# EAGLE design IMU_v2 (EAGLE 6.6.0)
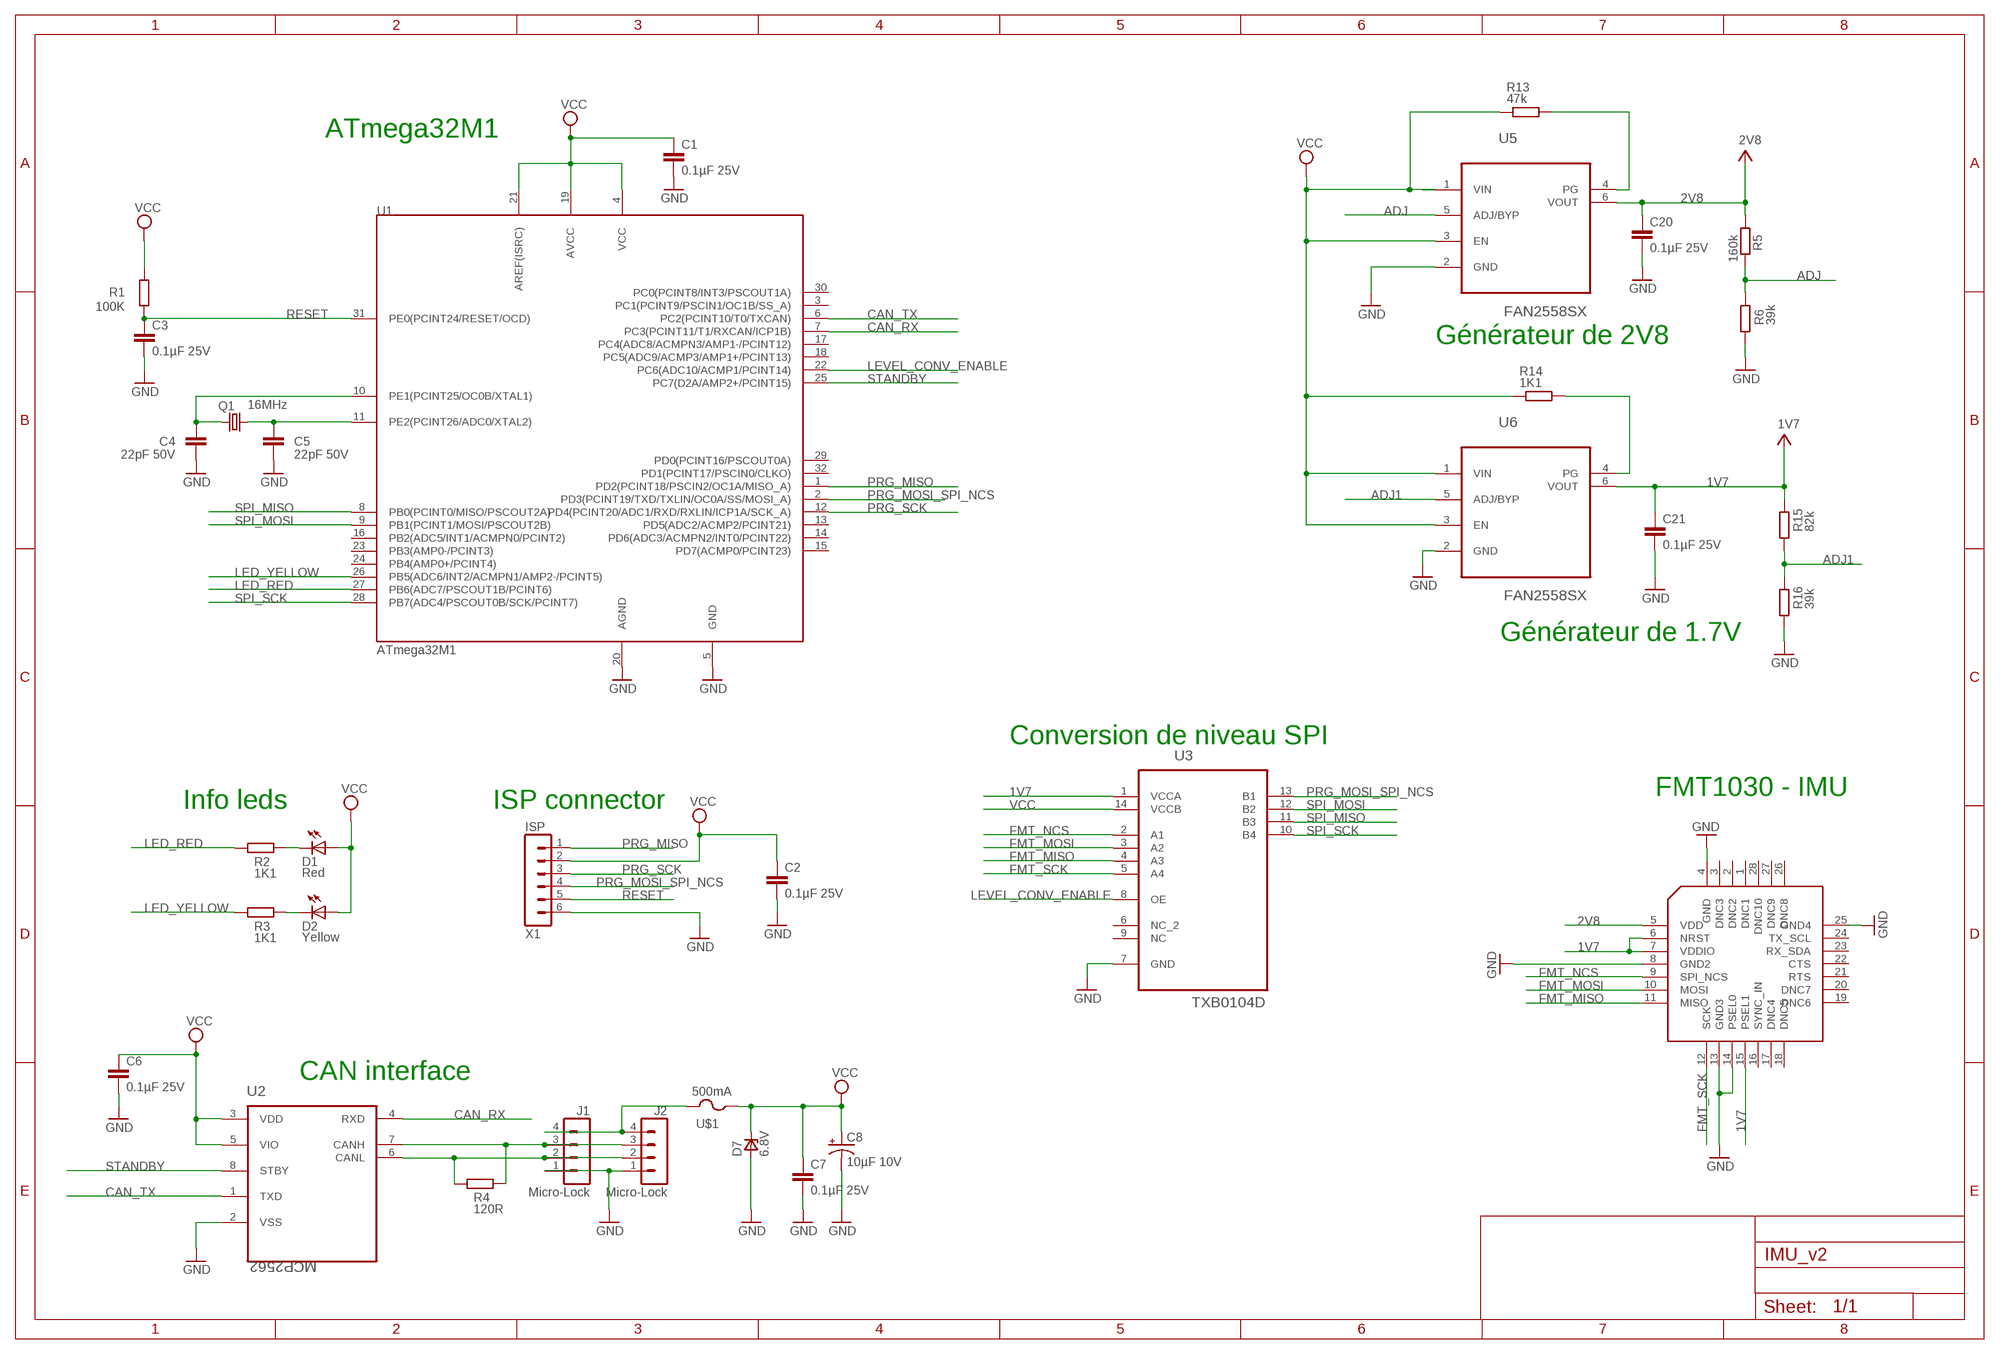
[diagram p0: schematic, sheet 1]

## Parts
C1  0.1µF 25V  CAPACITOR_NON_POL-0.1µF-25V(+-10%)(2012)  [C2012]
C2  0.1µF 25V  CAPACITOR_NON_POL-0.1µF-25V(+-10%)(2012)  [C2012]
C3  0.1µF 25V  CAPACITOR_NON_POL-0.1µF-25V(+-10%)(2012)  [C2012]
C4  22pF 50V  CAPACITOR_NON_POL-22PF-50V(+-5%)(2012)  [C2012]
C5  22pF 50V  CAPACITOR_NON_POL-22PF-50V(+-5%)(2012)  [C2012]
C6  0.1µF 25V  CAPACITOR_NON_POL-0.1µF-25V(+-10%)(2012)  [C2012]
C7  0.1µF 25V  CAPACITOR_NON_POL-0.1µF-25V(+-10%)(2012)  [C2012]
C8  10µF 10V  CAPACITOR_POL-10µF-10V(+-10%)(3216)  [EIA3216]
C20  0.1µF 25V  CAPACITOR_NON_POL-0.1µF-25V(+-10%)(2012)  [C2012]
C21  0.1µF 25V  CAPACITOR_NON_POL-0.1µF-25V(+-10%)(2012)  [C2012]
D1  Red  LEDVLDS1235G  [VLD]
D2  Yellow  LED-VLDY1235G  [VLD]
D7  6.8V  ZENER_UNIDIR6.8  [DO-214AA]
J1  Micro-Lock  MICROLOCK-4CMS  [504195-0470]
J2  Micro-Lock  MICROLOCK-4CMS  [504195-0470]
Q1  16MHz  CRYSTAL-16MHZ_SMD(3225)  [SMD_KX7]
R1  100K  RESISTOR-100K(+-1%)(2012)  [R2012]
R2  1K1  RESISTOR-1K1(+-1%)(2012)  [R2012]
R3  1K1  RESISTOR-1K1(+-1%)(2012)  [R2012]
R4  120R  RESISTOR-120R(+-1%)(2012)  [R2012]
R5  160k  RESISTOR-1K1(+-1%)(2012)  [R2012]
R6  39k  RESISTOR-1K1(+-1%)(2012)  [R2012]
R13  47k  RESISTOR-1K1(+-1%)(2012)  [R2012]
R14  1K1  RESISTOR-1K1(+-1%)(2012)  [R2012]
R15  82k  RESISTOR-1K1(+-1%)(2012)  [R2012]
R16  39k  RESISTOR-1K1(+-1%)(2012)  [R2012]
U1  ATmega32M1  ATMEGA32M1-TQFP32  [TQFP32]
U2  MCP2562  MCP2562-E/SN-SOIC8  [SOIC8]
U3  TXB0104D  [SOIC127P600X175-14N]
U5  FAN2558SX  [SOT95P270X145-6N]
U6  FAN2558SX  [SOT95P270X145-6N]
U$1  500mA  FUSE  [EIARS-481-2]
U$2  FMT1030  [S28]
X1  ISP  MINITEK_127_6WAYS-SMD  [MINITEK_127_6WAY_SMD]

## Nets
1V7: C21.1 R15.1 U3.1(VCCA) U6.6(VOUT) U$2.6(NRST) U$2.7(VDDIO) U$2.15(PSEL1)
2V8: C20.1 R5.1 U5.6(VOUT) U$2.5(VDD)
ADJ: R5.2 R6.1 U5.5(ADJ/BYP)
ADJ1: R15.2 R16.1 U6.5(ADJ/BYP)
CAN_RX: U1.7(PC3(PCINT11/T1/RXCAN/ICP1B)) U2.4(RXD)
CAN_TX: U1.6(PC2(PCINT10/T0/TXCAN)) U2.1(TXD)
FMT_MISO: U3.4(A3) U$2.11(MISO)
FMT_MOSI: U3.3(A2) U$2.10(MOSI)
FMT_NCS: U3.2(A1) U$2.9(SPI_NCS)
FMT_SCK: U3.5(A4) U$2.12(SCK)
GND: C1.2 C2.2 C3.2 C4.2 C5.2 C6.2 C7.2 C8.C(-) C20.2 C21.2 D7.A J1.1 J2.1 R6.2 R16.2 U1.5(GND) U1.20(AGND) U2.2(VSS) U3.7(GND) U5.2(GND) U6.2(GND) U$2.4(GND) U$2.8(GND2) U$2.13(GND3) U$2.14(PSEL0) U$2.25(GND4) X1.6
LED_RED: R2.2 U1.27(PB6(ADC7/PSCOUT1B/PCINT6))
LED_YELLOW: R3.2 U1.26(PB5(ADC6/INT2/ACMPN1/AMP2-/PCINT5))
LEVEL_CONV_ENABLE: U1.22(PC6(ADC10/ACMP1/PCINT14)) U3.8(OE)
N$2: D1.C R2.1
N$3: D2.C R3.1
N$4: J1.4 J2.4 U$1.2
N$5: J1.2 J2.2 R4.2 U2.6(CANL)
N$6: J1.3 J2.3 R4.1 U2.7(CANH)
N$7: C5.1 Q1.3 U1.11(PE2(PCINT26/ADC0/XTAL2))
N$9: C4.1 Q1.1 U1.10(PE1(PCINT25/OC0B/XTAL1))
N$12: R13.1 U5.4(PG)
N$14: R14.2 U6.4(PG)
PRG_MISO: U1.1(PD2(PCINT18/PSCIN2/OC1A/MISO_A)) X1.1
PRG_MOSI_SPI_NCS: U1.2(PD3(PCINT19/TXD/TXLIN/OC0A/SS/MOSI_A)) U3.13(B1) X1.4
PRG_SCK: U1.12(PD4(PCINT20/ADC1/RXD/RXLIN/ICP1A/SCK_A)) X1.3
RESET: C3.1 R1.1 U1.31(PE0(PCINT24/RESET/OCD)) X1.5
SPI_MISO: U1.8(PB0(PCINT0/MISO/PSCOUT2A)) U3.11(B3)
SPI_MOSI: U1.9(PB1(PCINT1/MOSI/PSCOUT2B)) U3.12(B2)
SPI_SCK: U1.28(PB7(ADC4/PSCOUT0B/SCK/PCINT7)) U3.10(B4)
STANDBY: U1.25(PC7(D2A/AMP2+/PCINT15)) U2.8(STBY)
VCC: C1.1 C2.1 C6.1 C7.1 C8.A(+) D1.A D2.A D7.C R1.2 R13.2 R14.1 U1.4(VCC) U1.19(AVCC) U1.21(AREF(ISRC)) U2.3(VDD) U2.5(VIO) U3.14(VCCB) U5.1(VIN) U5.3(EN) U6.1(VIN) U6.3(EN) U$1.1 X1.2
Unconnected: U1.3(PC1(PCINT9/PSCIN1/OC1B/SS_A)) U1.13(PD5(ADC2/ACMP2/PCINT21)) U1.14(PD6(ADC3/ACMPN2/INT0/PCINT22)) U1.15(PD7(ACMP0/PCINT23)) U1.16(PB2(ADC5/INT1/ACMPN0/PCINT2)) U1.17(PC4(ADC8/ACMPN3/AMP1-/PCINT12)) U1.18(PC5(ADC9/ACMP3/AMP1+/PCINT13)) U1.23(PB3(AMP0-/PCINT3)) U1.24(PB4(AMP0+/PCINT4)) U1.29(PD0(PCINT16/PSCOUT0A)) U1.30(PC0(PCINT8/INT3/PSCOUT1A)) U1.32(PD1(PCINT17/PSCIN0/CLKO)) U3.6(NC_2) U3.9(NC) U$2.1(DNC1) U$2.2(DNC2) U$2.3(DNC3) U$2.16(SYNC_IN) U$2.17(DNC4) U$2.18(DNC5) U$2.19(DNC6) U$2.20(DNC7) U$2.21(RTS) U$2.22(CTS) U$2.23(RX_SDA) U$2.24(TX_SCL) U$2.26(DNC8) U$2.27(DNC9) U$2.28(DNC10)

## Notes on the sheet
- ATmega32M1
- Générateur de 2V8
- Générateur de 1.7V
- Conversion de niveau SPI
- FMT1030 - IMU
- Info leds | ISP connector
- CAN interface

## Library data of the parts
C1-C3 C6 C7 C20 C21 = weklin_capacitor:CAPACITOR_NON_POL: Condensateur céramique multicouche; LIB: weklin_capacitor; MANUFACTURER: AVX; MPN: 08053C104KAT2A; OC_FARNELL: 2280951; PRICE: 0,0036
C4 C5 = weklin_capacitor:CAPACITOR_NON_POL: Condensateur céramique multicouche; LIB: weklin_capacitor; MANUFACTURER: Multicomp; MPN: MC0805N220J500CT; OC_FARNELL: 2310684; PRICE: 0,0078
C8 = weklin_capacitor:CAPACITOR_POL: Capacitor; LIB: weklin_capacitor; MANUFACTURER: Kemet; MPN: T491A106K010AT; OC_FARNELL: 2250086; PRICE: 0,0578
D1 = weklin_led:LED: Led; LIB: weklin_led; MANUFACTURER: Vishay; MPN: VLDS1235G; OC_FARNELL: 2494682; PRICE: 0,003
D2 = weklin_led:LED: Led; LIB: weklin_led; MANUFACTURER: Vishay; MPN: VLDY1235G; OC_FARNELL: 2494684; PRICE: 0,003
D7 = weklin_diode:ZENER_UNIDIR: P6SMBxxA Series of unidirectional Transient Voltage Suppressor Diodes xx = Stand-off Voltage VR in Volts; PPmax = 600 W Case: SMB = DO 214 AA Note: Footprint acc. to ST specs; source: www.st.com Author: Dipl.-Ing. FH Rainer Bayer, www.ing-rb.de/hhn Feedback: rainer.bayer@hs-heilbronn.de; LIB: weklin_diode; MANUFACTURER: ON Semiconductor; MPN: P6SMB6.8AT3G; OC_FARNELL: 1459166RL; PRICE: 0,178
J1 J2 = weklin_micro-lock:MICROLOCK-4: Connecteur MOLEX de 4 Contacts Série Mini50 GEII/IUT ANGERS; LIB: weklin_micro-lock; MANUFACTURER: Molex; MPN: 504195-0470; OC_FARNELL: 2445490; PRICE: 0,713
Q1 = weklin_crystal:CRYSTAL: Crystal resonator; LIB: weklin_crystal; MANUFACTURER: AEL CRYSTALS; MPN: E3SB16.0000F09G11AE; OC_FARNELL: 2467444RL; PRICE: 0,315
R1 = weklin_resistor:RESISTOR: Resistor; LIB: weklin_resistor; MANUFACTURER: Multicomp; MPN: MCWR08X1003FTL; OC_FARNELL: 2446868; PRICE: 0,0014
R2 R3 R14 = weklin_resistor:RESISTOR: Resistor; LIB: weklin_resistor; MANUFACTURER: Multicomp; MPN: MC0805S8F1101T5E; OC_FARNELL: 1635316; PRICE: 0,003
R4 = weklin_resistor:RESISTOR: Resistor; LIB: weklin_resistor; MANUFACTURER: Multicomp; MPN: MCWR08X1200FTL; OC_FARNELL: 2446878; PRICE: 0,0014
R5 R6 R13 R15 R16 = weklin_resistor:RESISTOR: Resistor; LIB: weklin_resistor; MANUFACTURER: Multicomp; MPN: MC0805S8F1101T5E; OC_FARNELL: 1635316; PRICE: 0,003; VALUE: 1K1
U1 = weklin_micro-atmell:ATMEGA32M1: ATMEL ATMEGA32M1-AU MCU 8 BITS ATMEGA 16MHZ; LIB: weklin_micro_atmell; MANUFACTURER: Atmel; MPN: ATmega32M1-AU; OC_FARNELL: 2443180; PRICE: 6,18
U2 = weklin_ic_can:MCP2562-E/SN: High-Speed CAN Transceiver; LIB: weklin_ic_can; MANUFACTURER: Microchip; MPN: MCP2562-E/SN; OC_FARNELL: 2362839; PRICE: 1,12
U3 = TXB0104D:TXB0104D: 4-BIT BIDIRECTIONAL VOLTAGE-LEVEL TRANSLATOR WITH AUTOMATIC DIRECTION SENSING AND ±15-kV ESD PROTECTION; MPN: TXB0104D; OC_FARNELL: 1607890; OC_NEWARK: 99K4464; PACKAGE: SOIC-14; SUPPLIER: TEXAS INSTRUMENTS
U5 U6 = FAN2558:FAN2558SX: 180mA Low Voltage CMOS LDO; MANUFACTURER: FAN2558SX; OC_FARNELL: 1564482; OC_NEWARK: 82H9202; PACKAGE: SOT-23-6; SUPPLIER: Fairchild
U$1 = weklin_fuse:FUSE: Fuse 500mA 125V ultra fast; LIB: weklin_fuse; MANUFACTURER: Littlefuse; MPN: 0451.500MRL; OC_FARNELL: 2383271; PRICE: 0,527
U$2 = Mercier:FMT1030
X1 = weklin_connector:MINITEK_127_6WAYS: Board-To-Board Connector, Micro-MaTch Series, Embase, 6voies.; LIB: weklin_connector; MANUFACTURER: Minitek; MPN: 20021121-00006C4LF; OC_FARNELL: 1865277; PRICE: 0,333

## Board
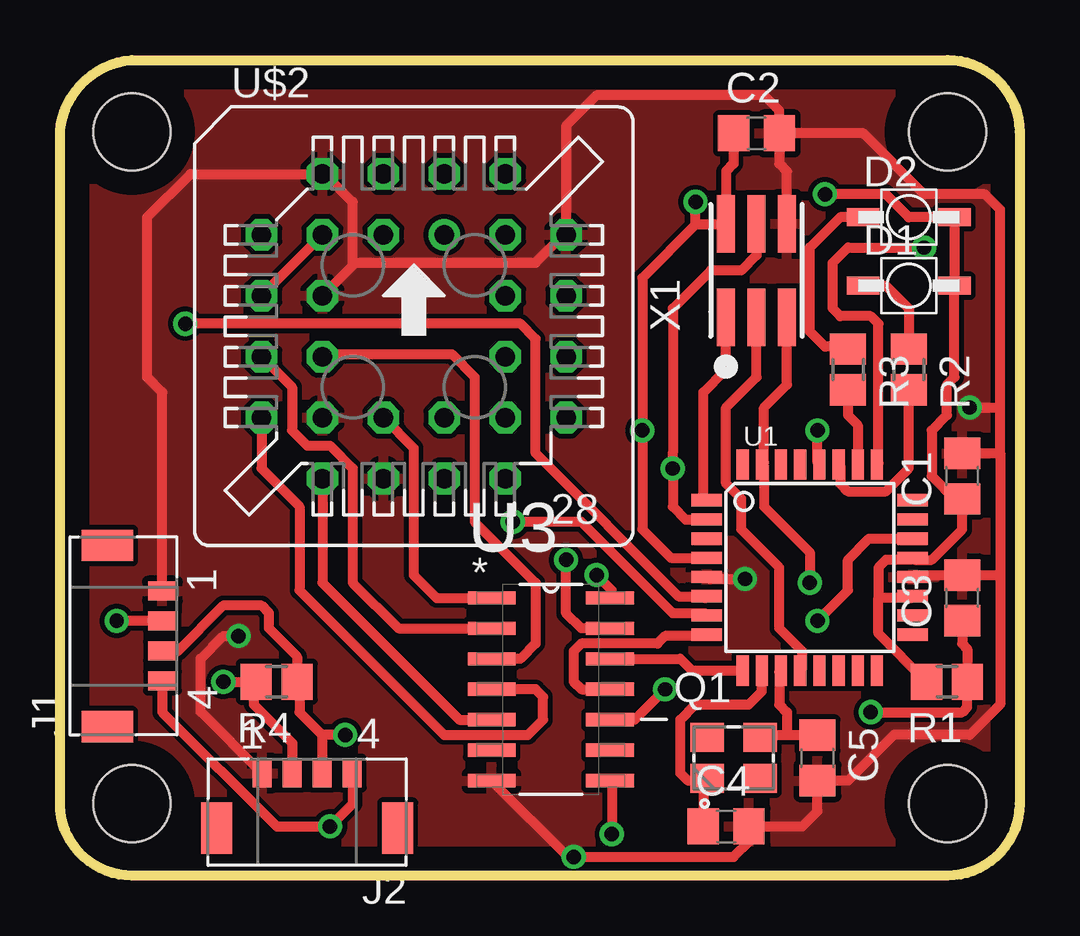
[diagram p1: board, top side]
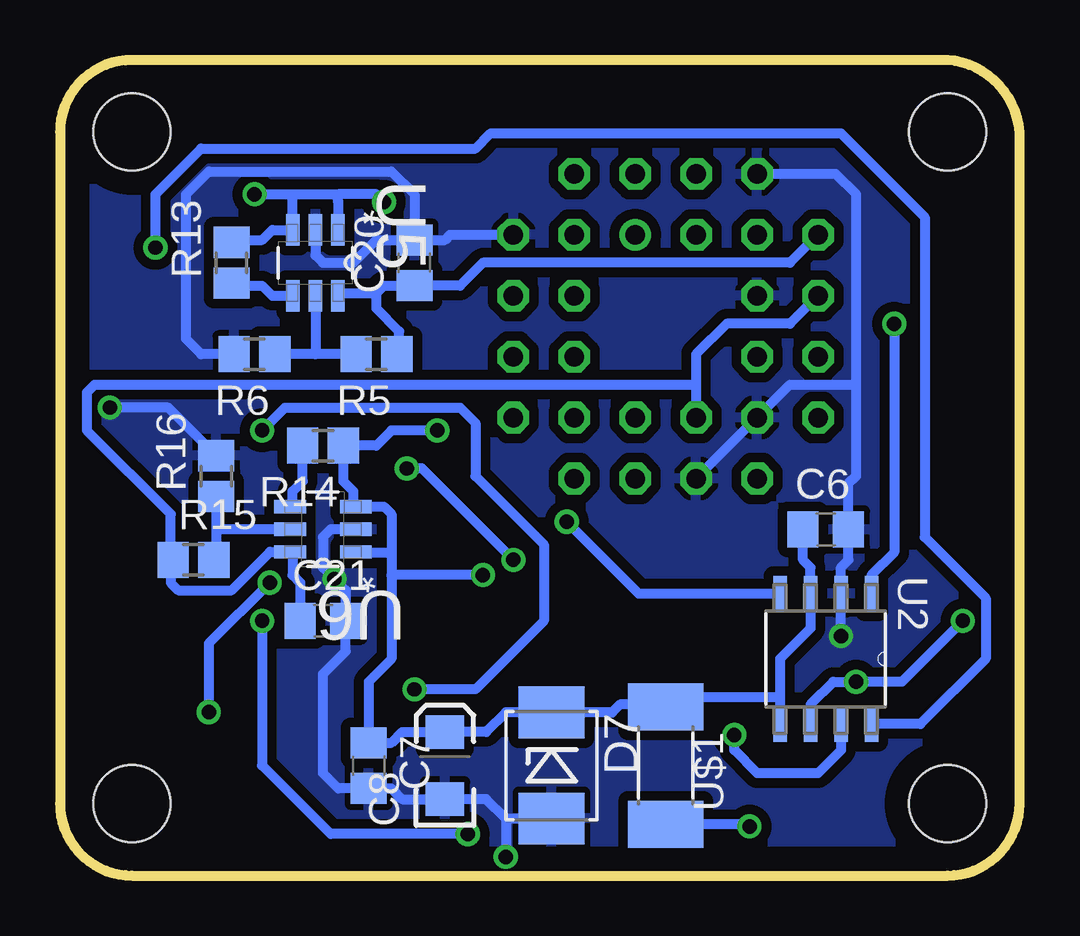
[diagram p2: board, bottom side, seen from below]

Size 40 x 34 mm. Coordinates in mm from the lower left corner, seen from the top.
Outline: 0,31 arc-81 3,34 37,34 arc-90 40,31 40,3 arc-90 37,0 3,0 arc-90 0,3 0,31
Copper layers (1*16): Top 0.035mm / dielectric 1.5mm / Bottom 0.035mm
Design rules "default": minimum track width 10mil, minimum drill 24mil, track to track 8mil, track to pad 8mil, pad to pad 8mil, via to via 8mil, smd to smd 8mil, copper to edge 40mil, drill to drill 8mil, minimum pad ring 10mil, minimum via ring 8mil, stop-mask expansion 4mil, vias tented up to drill 0mil, thermal gap 10mil
Holes 3.2 mm at 3,3 37,3 37,31 3,31

### Footprints (pad centres in the part's own frame; a part is rotated, then mirrored left to right if it is on the bottom)
C2012 = smd 1.3 x 1.5: 1 -0.95,0; 2 0.95,0
EIA3216 = smd 1.4 x 1.6: A 1.4,0; C -1.4,0
VLD = smd 0.75 x 1.35: A 0,1.9; C 0,-1.9
DO-214AA = smd 2.159 x 2.743: A 2.21,0; C -2.21,0
504195-0470 = smd 0.8 x 1.2: 1 1.875,0; 2 0.625,0; 3 -0.625,0; 4 -1.875,0 | smd 1.3 x 2.15: P$5 -3.775,2.295; P$6 3.775,2.295
SMD_KX7 = smd 1.4 x 1.2: 1 -1.1,-0.85; 2 1.1,-0.85; 3 1.1,0.85; 4 -1.1,0.85
R2012 = smd 1.3 x 1.5: 1 -0.85,0; 2 0.85,0
TQFP32 = smd 1.27 x 0.508: 1 -4.293,2.8; 2 -4.293,2; 3 -4.293,1.2; 4 -4.293,0.4; 5 -4.293,-0.4; 6 -4.293,-1.2; 7 -4.293,-2; 8 -4.293,-2.8; 17 4.293,-2.8; 18 4.293,-2; 19 4.293,-1.2; 20 4.293,-0.4; 21 4.293,0.4; 22 4.293,1.2; 23 4.293,2; 24 4.293,2.8 | smd 0.508 x 1.27: 9 -2.8,-4.293; 10 -2,-4.293; 11 -1.2,-4.293; 12 -0.4,-4.293; 13 0.4,-4.293; 14 1.2,-4.293; 15 2,-4.293; 16 2.8,-4.293; 25 2.8,4.293; 26 2,4.293; 27 1.2,4.293; 28 0.4,4.293; 29 -0.4,4.293; 30 -1.2,4.293; 31 -2,4.293; 32 -2.8,4.293
SOIC8 = smd 1.473 x 0.559: 1 -2.718,1.905; 2 -2.718,0.635; 3 -2.718,-0.635; 4 -2.718,-1.905; 5 2.718,-1.905; 6 2.718,-0.635; 7 2.718,0.635; 8 2.718,1.905
SOIC127P600X175-14N = smd 1.981 x 0.559: 1 -2.464,3.81; 2 -2.464,2.54; 3 -2.464,1.27; 4 -2.464,0; 5 -2.464,-1.27; 6 -2.464,-2.54; 7 -2.464,-3.81; 8 2.464,-3.81; 9 2.464,-2.54; 10 2.464,-1.27; 11 2.464,0; 12 2.464,1.27; 13 2.464,2.54; 14 2.464,3.81
SOT95P270X145-6N = smd 1.321 x 0.559: 1 -1.372,0.94; 2 -1.372,0; 3 -1.372,-0.94; 4 1.372,-0.94; 5 1.372,0; 6 1.372,0.94
EIARS-481-2 = smd 1.956 x 3.15: 1 -2.451,0; 2 2.451,0
S28 = drill 0.813: 1 1.27,3.81 | drill 0.813 octagon: 2 -1.27,6.35; 3 -1.27,3.81; 4 -3.81,6.35; 5 -6.35,3.81; 6 -3.81,3.81; 7 -6.35,1.27; 8 -3.81,1.27; 9 -6.35,-1.27; 10 -3.81,-1.27; 11 -6.35,-3.81; 12 -3.81,-6.35; 13 -3.81,-3.81; 14 -1.27,-6.35; 15 -1.27,-3.81; 16 1.27,-6.35; 17 1.27,-3.81; 18 3.81,-6.35; 19 6.35,-3.81; 20 3.81,-3.81; 21 6.35,-1.27; 22 3.81,-1.27; 23 6.35,1.27; 24 3.81,1.27; 25 6.35,3.81; 26 3.81,6.35; 27 3.81,3.81; 28 1.27,6.35
MINITEK_127_6WAY_SMD = smd 0.76 x 2.4: 1 -1.27,-1.95; 2 -1.27,1.95; 3 0,-1.95; 4 0,1.95; 5 1.27,-1.95; 6 1.27,1.95

### Placement (x,y rotation side)
C1  37.61,16.65 90 top
C2  29.04,30.94 0 top
C3  37.61,11.57 90 top
C4  27.77,2.05 0 top
C5  31.57,4.91 270 top
C6  8.08,14.43 0 bottom
C7  27.13,4.59 270 bottom
C8  23.95,4.59 90 bottom
C20  25.23,25.54 90 bottom
C21  29.04,10.62 0 bottom
D1  35.38,24.59 270 top
D2  35.38,27.45 270 top
D7  19.51,4.59 270 bottom
J1  4.27,9.98 90 top
J2  10.3,4.27 180 top
Q1  28.08,4.91 0 top
R1  36.97,8.08 180 top
R2  35.38,21.1 270 top
R3  32.84,21.1 270 top
R4  9.03,8.08 180 top
R5  26.81,21.73 180 bottom
R6  31.89,21.73 180 bottom
R13  32.84,25.54 90 bottom
R14  29.04,17.92 180 bottom
R15  34.43,13.16 0 bottom
R16  33.48,16.65 90 bottom
U1  31.26,12.84 0 top
U2  8.08,9.03 270 bottom
U3  20.46,7.76 0 top
U5  29.35,25.54 270 bottom
U6  29.04,14.43 180 bottom
U$1  14.75,4.59 270 bottom
U$2  14.75,22.9 0 top
X1  29.04,25.23 0 top

### Tracks (layer width: path | path; a pad name or v marks a point on that pad's centre or on a via)
1V7
  Top 0.406: U$2.15 14.75,17.82 14.75,12.53 15.7,11.57 U3.1 | U$2.7 U$2.6
  Bottom 0.406: C21.1 29.98,12.21 30.3,12.53 30.3,13.39 U6.6 31.25,13.49 32.84,11.89 35.07,11.89 35.38,12.21 35.38,13.06 R15.1 35.38,13.26 35.38,15.06 38.88,18.56 38.88,20.14 38.56,20.46 13.48,20.46 | U$2.7 9.57,23 12.21,23 13.48,21.73 13.48,20.46 | 13.48,20.46 U$2.15
2V8
  Bottom 0.406: R5.1 25.86,21.84 25.86,22.68 26.81,23.64 26.81,24.27 | 26.81,24.27 26.49,24.59 C20.1 23.32,24.59 22.37,25.54 9.57,25.54 U$2.5 | U5.6 28.31,24.27 26.81,24.27
ADJ
  Bottom 0.406: R5.2 29.35,21.73 | 29.35,21.73 R6.1 | U5.5 29.35,21.73
ADJ1
  Bottom 0.406: U6.5 33.48,14.43 | R16.1 33.48,14.43 | 33.48,14.43 33.48,13.79 33.58,13.69 R15.2
CAN_RX  (via drill 0.6)
  Top 0.406: U1.7 26.87,10.94 25.54,10.94 21.73,14.75 v18.88,14.75
  Bottom 0.406: v18.88,14.75 15.88,11.75 U2.4
CAN_TX  (via drill 0.6)
  Top 0.406: 26.89,11.57 U1.6 25.79,11.64 19.83,17.61 19.83,22.37 19.19,23 v5.22,23
  Bottom 0.406: v5.22,23 5.22,13.48 6.17,12.53 U2.1
FMT_MISO
  Top 0.406: U$2.11 8.4,16.97 9.98,15.38 9.98,11.89 16.02,5.86 19.51,5.86 20.14,6.49 20.14,7.45 19.83,7.76 U3.4
FMT_MOSI
  Top 0.406: U$2.10 11.04,21.73 16.34,21.73 17.29,20.78 17.29,14.75 19.83,12.21 19.83,9.67 19.19,9.03 U3.3
FMT_NCS
  Top 0.406: U$2.9 9.67,20.36 9.67,18.56 10.3,17.92 11.26,17.92 12.21,16.97 12.21,12.21 14.11,10.3 U3.2
FMT_SCK
  Top 0.406: U$2.12 10.94,12.21 16.65,6.49 U3.5
GND  (via drill 0.6)
  Top 0.406: C2.2 33.48,30.94 36.02,28.4 38.56,28.4 39.2,27.77 39.2,19.51 | C2.2 29.99,29.67 30.3,29.35 X1.6 | C5.2 31.57,2.68 30.94,2.05 C4.2 28.72,1.41 28.08,0.78 v21.41,0.78 21.17,0.78 U3.7 | U1.20 35.63,12.52 C3.2 39.2,12.53 | C2.2 29.99,31.89 29.35,32.53 22.37,32.53 21.1,31.26 U$2.25 21,26.71 19.83,25.54 12.31,25.54 12.21,25.44 | U$2.8 12.21,25.44 | 12.21,25.44 12.21,28.08 11.04,29.25 U$2.4 5.44,29.25 3.63,27.45 3.63,20.78 4.27,20.14 J1.1 | U1.5 27.04,12.37 v28.56,12.37 | 39.2,17.61 39.2,12.53 | 39.2,12.53 39.2,7.13 37.92,5.86 34.75,5.86 32.85,3.96 C5.2 | 31.89,3.96 C5.2 | 38.56,17.6 C1.2 39.2,17.61 | 39.2,17.61 39.2,19.51 | v37.92,19.51 39.2,19.51 | J2.1 5.86,6.84 5.86,9.03 6.81,9.98 v7.45,9.98
  Bottom 0.406: D7.A 19.52,2.37 21.41,2.37 | U6.2 28.72,14.43 29.04,14.11 29.04,12.84 v28.56,12.37 28.09,11.89 C21.2 28.09,9.35 29.04,8.4 29.04,4.27 28.4,3.63 C7.2 26.18,3.63 25.73,3.19 C8.C 22.24,3.19 21.41,2.37 | U5.2 29.35,25.86 29.04,25.54 27.77,25.54 26.82,26.49 C20.2 | C20.2 23.95,26.5 23.74,26.71 U$2.25 | 6.81,20.46 9.57,20.46 U$2.13 U$2.14 | 6.81,20.46 6.81,16.65 7.13,16.34 C6.2 7.13,13.16 7.45,12.84 U2.2 v7.45,9.98 | 6.81,20.46 6.81,28.4 7.66,29.25 U$2.4 | R6.2 34.11,21.73 34.75,22.37 34.75,28.4 33.8,29.35 26.18,29.35 25.23,28.4 C20.2 | 21.41,2.37 v21.41,0.78 | R16.2 35.49,19.51 v37.92,19.51
  pour Bottom (isolate 0.406): 3,33.8 arc90 0.14,30.94 0.14,3 arc90 3,0.14 36.97,0.14 arc90 39.83,3 39.83,30.94 arc90 36.97,33.8
  pour Top: 3,34.11 arc90 0.14,31.26 0.14,3 arc90 3,0.14 36.97,0.14 arc90 39.83,3 39.83,30.94 arc90 36.66,34.11
LED_RED
  Top 0.406: U1.27 32.53,17.06 32.53,16.34 32.84,16.02 34.43,16.02 35.38,16.97 R2.2
LED_YELLOW
  Top 0.406: R3.2 32.84,19.19 33.26,18.78 U1.26
LEVEL_CONV_ENABLE  (via drill 0.6)
  Top 0.406: U3.8 23,3.88 v23,1.73 | U1.22 33.73,14.04 32.84,13.16 32.84,11.89 v31.57,10.62
  Bottom 0.406: v23,1.73 28.72,1.73 31.57,4.59 v31.57,10.62
N$2
  Top 0.406: D1.C 34.43,24.59 35.38,23.64 R2.1
N$3
  Top 0.406: D2.C 32.53,27.45 31.26,26.18 31.26,22.68 31.89,22.05 32.74,22.05 R3.1
N$4  (via drill 0.6)
  Top 0.406: J2.4 12.21,4.24 12.21,3 v11.26,2.05 9.03,2.05 4.27,6.81 J1.4
  Bottom 0.406: v11.26,2.05 11.34,2.14 U$1.2
N$5  (via drill 0.6)
  Top 0.406: J2.2 9.68,5.53 8.08,7.13 8.08,7.98 R4.2 v6.81,8.08 | J1.2 v2.37,10.62
  Bottom 0.406: v2.37,10.62 4.91,8.08 v6.81,8.08 7.76,8.08 8.71,7.13 U2.6
N$6  (via drill 0.6)
  Top 0.406: 10.93,5.87 9.98,6.81 9.98,7.98 R4.1 9.88,9.13 8.71,10.3 8.71,10.94 8.4,11.26 6.81,11.26 4.91,9.35 J1.3 | 10.93,5.87 J2.3 | v11.89,5.86 v11.88,5.87 10.93,5.87
  Bottom 0.406: U2.7 7.45,5.22 8.4,4.27 J2.3 11.89,5.23 v11.89,5.86
N$7
  Top 0.406: Q1.3 29.28,5.86 30.3,5.86 | 30.3,5.86 C5.1 | U1.11 29.99,8.48 29.99,7.13 30.3,6.81 30.3,5.86
N$9
  Top 0.406: C4.1 26.82,3.89 Q1.1 26.88,3.95 26.18,3.95 25.86,4.27 25.86,6.49 26.5,7.13 28.72,7.13 29.26,7.67 U1.10
N$12
  Bottom 0.406: R13.1 32.74,24.59 31.57,24.59 31.16,24.17 U5.4
N$14
  Bottom 0.406: U6.4 30.3,15.47 30.3,16.02 29.89,16.44 R14.2
PRG_MISO
  Top 0.406: U1.1 26.81,15.79 26.81,20.14 27.77,21.1 X1.1
PRG_MOSI_SPI_NCS  (via drill 0.6)
  Top 0.406: X1.4 29.04,25.86 28.4,25.23 27.13,25.23 25.54,23.64 25.54,17.61 v25.54,16.97 25.54,15.38 26.08,14.84 U1.2 | U3.13 21.73,10.3 21.1,10.94 v21.1,13.16
  Bottom 0.406: v21.1,13.16 24.91,16.97 v25.54,16.97
PRG_SCK
  Top 0.406: U1.12 30.94,8.63 30.94,9.35 29.99,10.3 29.99,12.84 28.4,14.43 28.4,15.7 27.77,16.34 27.77,19.51 29.04,20.78 X1.3
RESET  (via drill 0.6)
  Top 0.406: X1.5 30.3,20.46 29.35,19.51 29.35,17.23 U1.31 29.35,17.04 29.35,15.38 31.26,13.48 v31.26,12.21 | C3.1 37.61,9.67 37.82,9.45 R1.1 37.82,7.03 37.61,6.81 v33.8,6.81
  Bottom 0.406: v31.26,12.21 33.8,9.67 v33.8,6.81
SPI_MISO
  Top 0.406: U1.8 26.91,9.98 25.23,9.98 24.91,9.67 21.73,9.67 21.41,9.35 21.41,8.08 21.73,7.76 U3.11
SPI_MOSI
  Top 0.406: U3.12 25.86,9.03 26.34,8.55 U1.9
SPI_SCK  (via drill 0.6)
  Top 0.406: U1.28 31.57,17.22 v31.57,18.56 | v25.23,7.76 23.95,6.49 U3.10
  Bottom 0.406: v25.23,7.76 22.68,7.76 19.83,10.62 19.83,13.79 22.68,16.65 22.68,18.88 23.32,19.51 30.62,19.51 v31.57,18.56
STANDBY  (via drill 0.6)
  Top 0.406: U1.25 34.11,17.19 34.11,23 33.8,23.32 32.53,23.32 32.21,23.64 32.21,25.54 32.84,26.18 v36.02,26.18
  Bottom 0.406: v36.02,26.18 36.02,28.4 34.11,30.3 22.68,30.3 22.05,30.94 7.45,30.94 3.95,27.45 3.95,14.11 1.41,11.57 1.41,9.03 4.13,6.31 U2.8
VCC  (via drill 0.6)
  Top 0.406: C2.1 28.08,29.67 27.77,29.35 X1.2 27.72,27.13 26.5,27.13 | D2.A D1.A 37.28,20.77 36.97,20.46 36.97,19.19 36.34,18.56 36.34,16.65 37.29,15.7 C1.1 37.61,14.43 36.34,13.16 35.63,13.16 U1.21 35.47,13.16 34.43,13.16 34.11,12.84 34.11,11.57 | U1.19 35.48,11.57 34.11,11.57 | R1.2 34.11,10.09 34.11,11.57 | U3.14 23,11.65 23,11.89 v22.37,12.53 | U1.4 25.46,13.24 24.27,14.43 v24.27,18.56 24.27,24.91 26.5,27.13 | 26.5,27.13 v26.5,28.08 | D2.A | D2.A 35.38,27.45 34.43,28.4 v31.89,28.4
  Bottom 0.406: C6.1 9.03,13.16 8.71,12.84 U2.3 8.71,10.3 9.98,9.03 9.98,7.45 | 9.98,7.45 U2.5 | 9.98,7.45 14.34,7.45 U$1.1 14.84,7.13 16.65,7.13 16.98,6.8 D7.C 19.52,6.81 21.41,6.81 22.24,5.99 C8.A 25.73,5.99 26.18,5.54 C7.1 27.13,8.08 26.18,9.03 26.18,12.53 | R13.2 32.74,26.5 31.57,26.5 31.16,26.91 U5.3 30.3,26.93 30.3,28.4 | U5.1 28.41,28.09 28.4,28.11 28.4,28.4 | 26.18,13.48 26.18,15.06 26.5,15.38 27.65,15.38 U6.3 27.77,15.47 27.77,16.02 28.18,16.44 R14.1 26.81,17.92 26.18,18.56 v24.27,18.56 | 26.18,13.48 26.18,12.53 | U6.1 27.65,13.48 26.18,13.48 | v22.37,12.53 26.18,12.53 | v26.5,28.08 26.81,28.4 28.4,28.4 | v31.89,28.4 30.3,28.4 | 30.3,28.4 28.4,28.4